# EAGLE board project-tsc (EAGLE 9.7.0), part 1 of 2
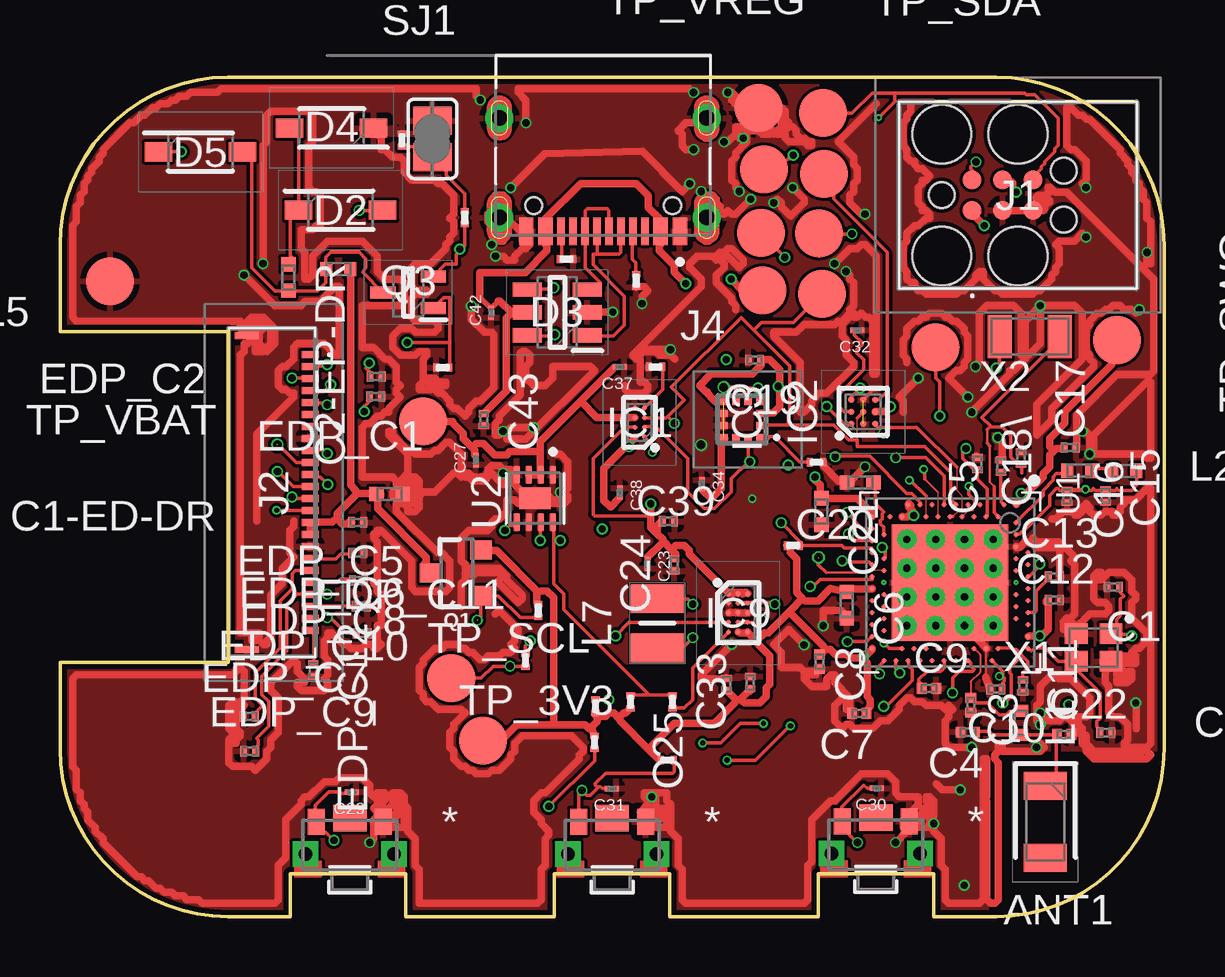
[diagram p1: board, top side]
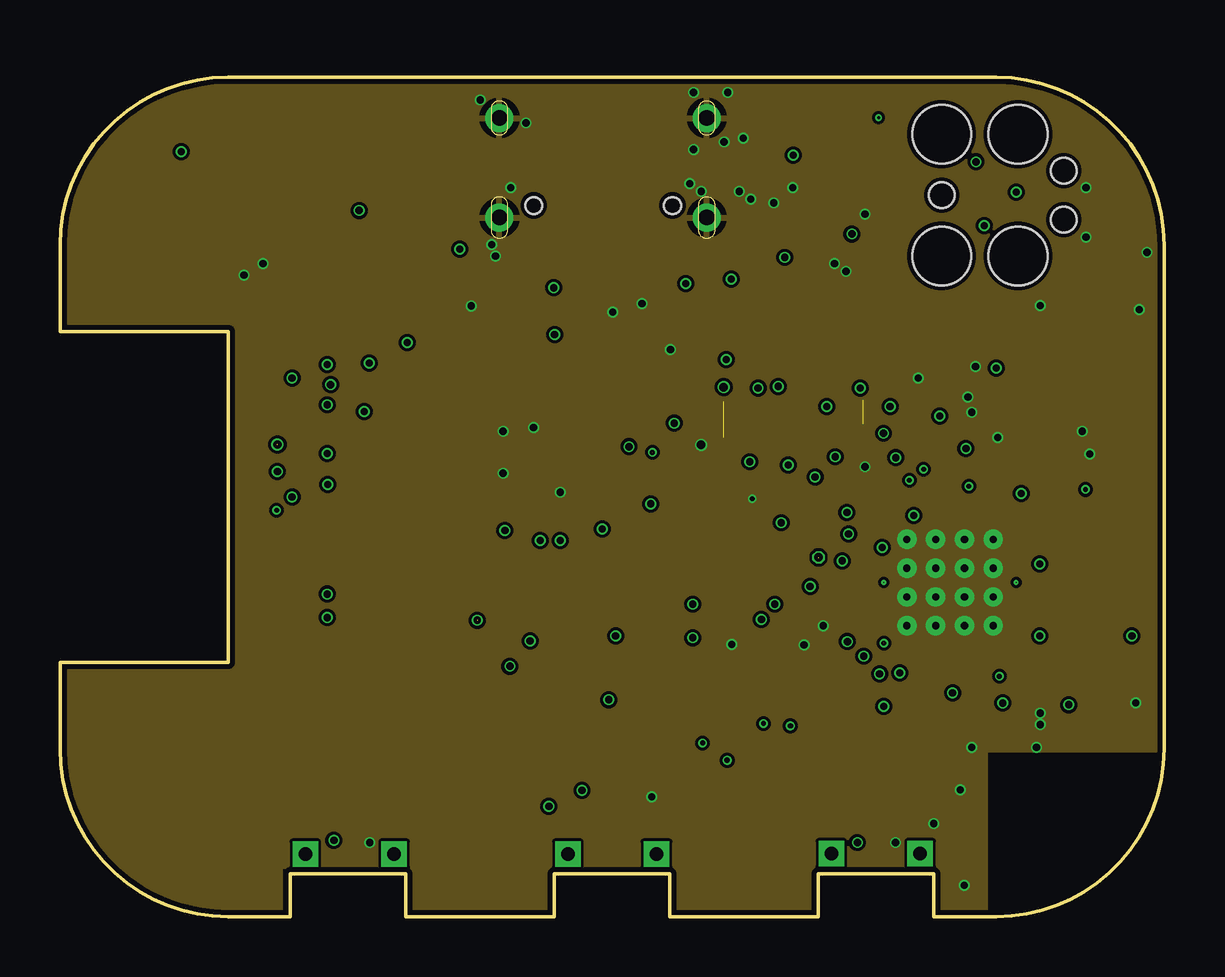
[diagram p2: board, inner layer Route2]
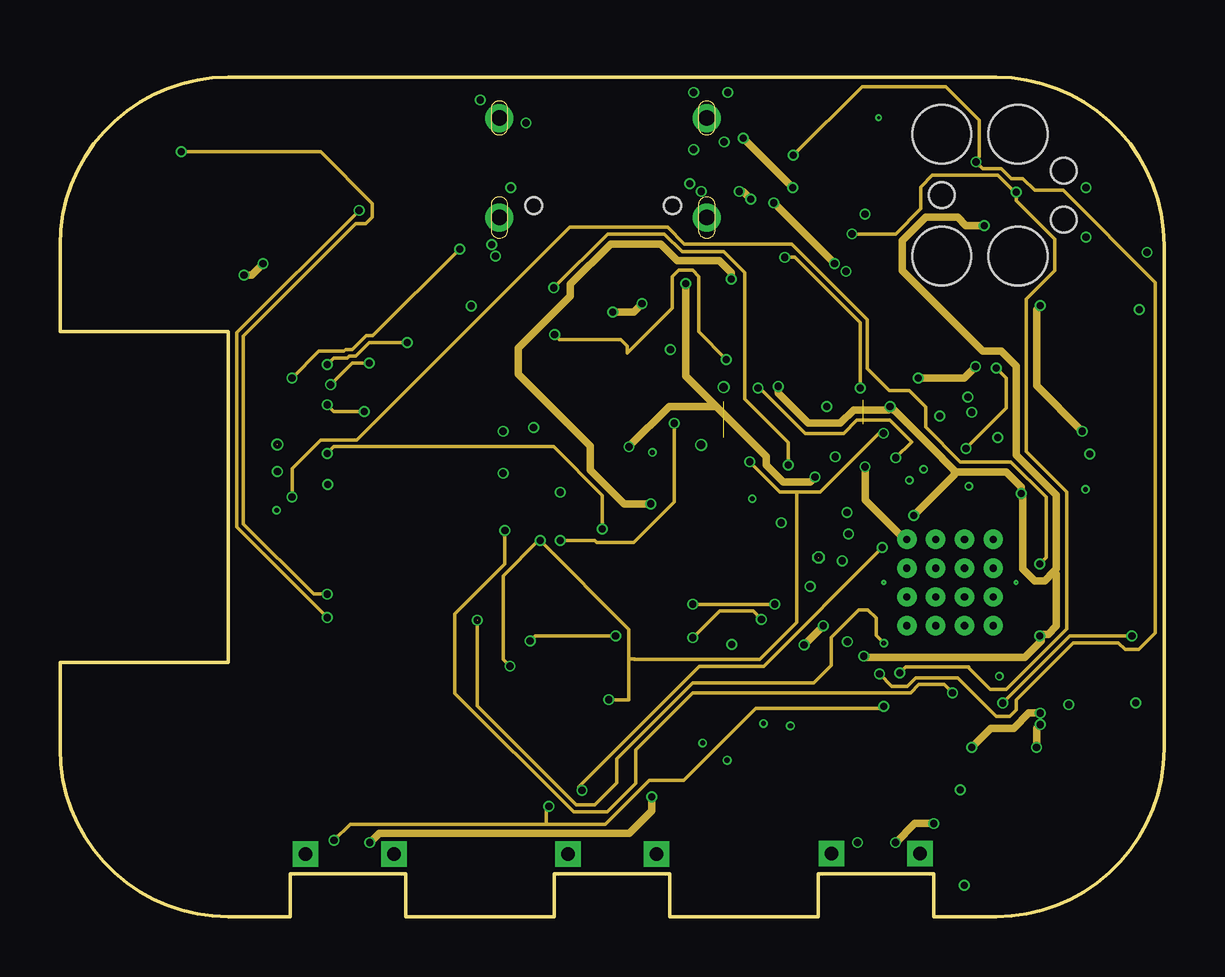
[diagram p3: board, inner layer Route15]
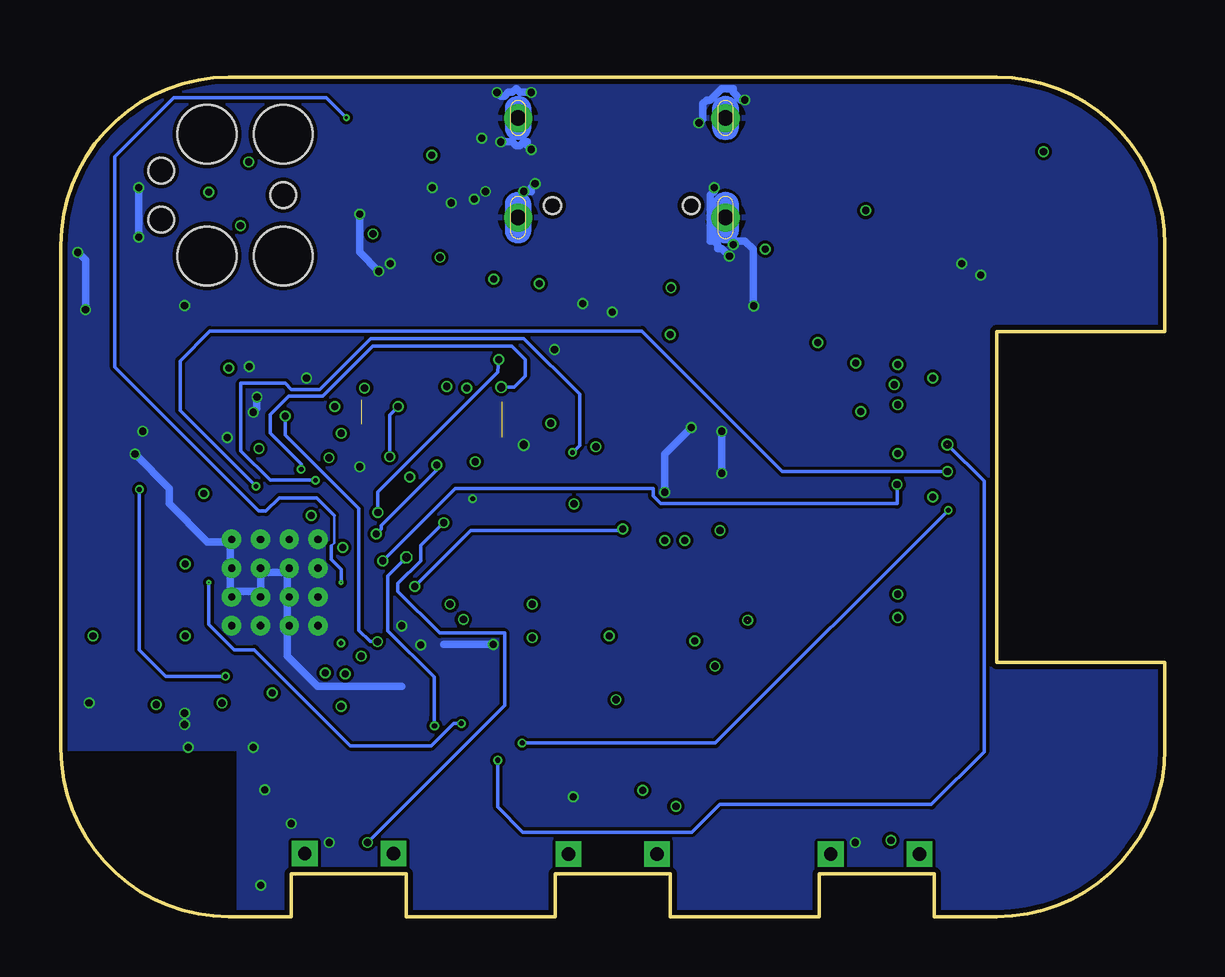
[diagram p4: board, bottom side, seen from below]

Size 46 x 35 mm. Coordinates in mm from the lower left corner, seen from the top.
Outline: 39,0 36.4,0 36.4,1.8 31.6,1.8 31.6,0 25.4,0 25.4,1.8 20.6,1.8 20.6,0 14.4,0 14.4,1.8 9.6,1.8 9.6,0 7,0 arc-90 0,7 0,10.6 7,10.6 7,24.4 0,24.4 0,28 arc-90 7,35 39,35 arc-90 46,28 46,7 arc-90 39,0
Copper layers (1+2*15+16): Top 0.035mm / dielectric 1.6mm / Route2 0.035mm / dielectric 0.15mm / Route15 0.035mm / dielectric 0.2mm / Bottom 0.035mm
Design rules "jlcpcb-2layers.dru *": minimum track width 6mil, minimum drill 0.2mm, track to track 5mil, track to pad 5mil, pad to pad 5mil, via to via 5mil, smd to smd 5mil, copper to edge 0.2mm, drill to drill 6mil, minimum pad ring 10mil, minimum via ring 3mil, stop-mask expansion 4mil, vias tented up to drill 999mm, thermal gap 10mil
Net classes: 1 POWER: width 0.305 mm

## Footprints (pad centres in the part's own frame; a part is rotated, then mirrored left to right if it is on the bottom)
2450AT18B100E_ANTC3216X140N = smd 1.15 x 1.8: 1 -1.5,0; 2 1.5,0
NORDIC_NRF_3_RESC0201_L = smd 0.28 x 0.43: 1 -0.255,0; 2 0.255,0
NORDIC_NRF_3_RESC0402_N = smd 0.6 x 0.6: 1 -0.55,0; 2 0.55,0
NORDIC_NRF_3_RESC0201_N = smd 0.4 x 0.45: 1 -0.305,0; 2 0.305,0
GRM011R60J152KE01L_2_CAPC0201X13N = smd 0.22 x 0.23: 1 -0.185,0; 2 0.185,0
ESP32_C6_LIBRARY_5_SOD3716X135N = smd 1.15 x 0.8: 1 -1.75,0; 2 1.75,0
ESP32_C6_LIBRARY_3_SOT95P280X145-6N = smd 1.2 x 0.6: 1 -1.25,0.95; 2 -1.25,0; 3 -1.25,-0.95; 4 1.25,-0.95; 5 1.25,0; 6 1.25,0.95
BQ25180YBGR_BGA8C40P2X4_100X155X50 = smd 0.2 x 0.2: A1 -0.2,0.6; A2 0.2,0.6; B1 -0.2,0.2; B2 0.2,0.2; C1 -0.2,-0.2; C2 0.2,-0.2; D1 -0.2,-0.6; D2 0.2,-0.6
DRV2605YZFR_BGA9C50P3X3_144X144X62 = smd 0.25 x 0.25: A1 -0.5,0.5; A2 0,0.5; A3 0.5,0.5; B1 -0.5,0; B2 0,0; B3 0.5,0; C1 -0.5,-0.5; C2 0,-0.5; C3 0.5,-0.5
BMA423_BMA423 = smd 0.3 x 0.35: 1 -0.75,-0.775; 2 -0.25,-0.775; 3 0.25,-0.775; 4 0.75,-0.775; 7 0.75,0.775; 8 0.25,0.775; 9 -0.25,0.775; 10 -0.75,0.775 | smd 0.35 x 0.3: 5 0.775,-0.25; 6 0.775,0.25; 11 -0.775,0.25; 12 -0.775,-0.25
RT6160AWSC_BGA15C40P3X5_140X230X60 = smd 0.216 x 0.216: A1 -0.4,0.8; A2 0,0.8; A3 0.4,0.8; B1 -0.4,0.4; B2 0,0.4; B3 0.4,0.4; C1 -0.4,0; C2 0,0; C3 0.4,0; D1 -0.4,-0.4; D2 0,-0.4; D3 0.4,-0.4; E1 -0.4,-0.8; E2 0,-0.8; E3 0.4,-0.8
TC2030-IDC_TC2030IDC = smd 0.783 x 0.783: 1 -0.953,-0.635; 2 -0.953,0.635; 3 0.317,-0.635; 4 0.317,0.635; 5 1.588,-0.635; 6 1.588,0.635 | hole 2.451: -2.223,-2.54; -2.223,2.54; 0.952,-2.54; 0.952,2.54 | hole 1.067: -2.223,0; 2.857,-1.016; 2.857,1.016
503480-2400_5034802400 = smd 0.3 x 0.7: 1 -5.75,1.525; 2 -5.25,1.525; 3 -4.75,1.525; 4 -4.25,1.525; 5 -3.75,1.525; 6 -3.25,1.525; 7 -2.75,1.525; 8 -2.25,1.525; 9 -1.75,1.525; 10 -1.25,1.525; 11 -0.75,1.525; 12 -0.25,1.525; 13 0.25,1.525; 14 0.75,1.525; 15 1.25,1.525; 16 1.75,1.525; 17 2.25,1.525; 18 2.75,1.525; 19 3.25,1.525; 20 3.75,1.525; 21 4.25,1.525; 22 4.75,1.525; 23 5.25,1.525; 24 5.75,1.525 | smd 0.3 x 1: MP1 -6.54,-1.125; MP2 6.54,-1.125
KH-TYPE-C-16P_KINGHELM_KH-TYPE-C-16P = smd 0.6 x 1.15: A1_B12 -3.2,4.725; A4_B9 -2.4,4.725; A9_B4 2.4,4.725; A12_B1 3.2,4.725 | smd 0.3 x 1.15: A5 -1.25,4.725; A6 -0.25,4.725; A7 0.25,4.725; A8 1.25,4.725; B5 1.75,4.725; B6 0.75,4.725; B7 -0.75,4.725; B8 -1.75,4.725 | drill 0.65 pad 1.05: SH1 -4.32,0; SH2 4.32,0; SH3 -4.32,4.15; SH4 4.32,4.15 | hole 0.7: -2.89,3.65; 2.89,3.65
NORDIC_NRF_2_RESC0402_L = smd 0.5 x 0.6: 1 -0.5,0; 2 0.5,0
MLP2016SR47MT0S1_INDC2016X100N = smd 1.2 x 2.2: 1 -1.028,0; 2 1.028,0
ESP32_C6_LIBRARY_4_ESP32_C6_LIBRARY_4_ESP32_C6_LIBRARY_4_ESP32_C6_LIBRARY_4_ESP32_WROVER_SPARKFUN-DISCRETESEMI_SOT23-3 = smd 0.8 x 0.9: 1 -0.95,-1; 2 0.95,-1; 3 0,1.1
ESP32_C6_LIBRARY_6_SOT65P210X110-3N = smd 1.05 x 0.5: 1 -1.05,0.65; 2 -1.05,-0.65; 3 1.05,0
CPF0201D7K68C1_0201 = smd 0.35 x 0.25: 1 0,0.275; 2 0,-0.275
ESP32_C6_LIBRARY_7_JUMPER_SJ = smd 1.168 x 1.6: 1 -0.762,0; 2 0.762,0
2025-10-22_07-23-44_LIBRARY_SW_EVP-AKE31A_PAN = smd 0.711 x 1.092: 1 -1.4,-0.972; 2 1.4,-0.972 | drill 0.559 pad 0.914 square: 3 -1.848,0.381; 4 1.848,0.381 | smd 1.397 x 1.092: 5 0,-1.124
HECTOR_WATCH_1_TP20R = smd 2 x 2: TP 0,0
NORDIC_NRF_4_AQFN50P700X700X85_HS-74N = smd 4.85 x 4.85: P$74 0,0 | drill 0.3 pad 0.6: P$75 -1.8,1.8; P$76 -0.6,1.8; P$77 0.6,1.8; P$78 1.8,1.8; P$79 -1.8,0.6; P$80 -0.6,0.6; P$81 0.6,0.6; P$82 1.8,0.6; P$83 -1.8,-0.6; P$84 -0.6,-0.6; P$85 0.6,-0.6; P$86 1.8,-0.6; P$87 -1.8,-1.8; P$88 -0.6,-1.8; P$89 0.6,-1.8; P$90 1.8,-1.8 | smd 0.2 x 0.2: P$A8 -1.25,3.25; P$A10 -0.75,3.25; P$A12 -0.25,3.25; P$A14 0.25,3.25; P$A16 0.75,3.25; P$A18 1.25,3.25; P$A20 1.75,3.25; P$A22 2.25,3.25; P$A23 2.75,3.25; P$AA24 3.25,-2.25; P$AB2 -2.75,-2.5; P$AC5 -2,-2.75; P$AC9 -1,-2.75; P$AC11 -0.5,-2.75; P$AC13 0,-2.75; P$AC15 0.5,-2.75; P$AC17 1,-2.75; P$AC19 1.5,-2.75; P$AC21 2,-2.75; P$AC24 3.25,-2.75; P$AD2 -2.75,-3.25; P$AD4 -2.25,-3.25; P$AD6 -1.75,-3.25; P$AD8 -1.25,-3.25; P$AD10 -0.75,-3.25; P$AD12 -0.25,-3.25; P$AD14 0.25,-3.25; P$AD16 0.75,-3.25; P$AD18 1.25,-3.25; P$AD20 1.75,-3.25; P$AD22 2.25,-3.25; P$AD23 2.75,-3.25; P$B1 -3.25,2.75; P$B3 -2.5,2.75; P$B5 -2,2.75; P$B7 -1.5,2.75; P$B9 -1,2.75; P$B11 -0.5,2.75; P$B13 0,2.75; P$B15 0.5,2.75; P$B17 1,2.75; P$B19 1.5,2.75; P$B24 3.25,2.75; P$C1 -3.25,2.25; P$D2 -2.75,2; P$D23 2.75,2; P$E24 3.25,1.75; P$F2 -2.75,1.5; P$F23 2.75,1.5; P$G1 -3.25,1.25; P$H2 -2.75,1; P$H23 2.75,1; P$J1 -3.25,0.75; P$J24 3.25,0.75; P$K2 -2.75,0.5; P$L1 -3.25,0.25; P$L24 3.25,0.25; P$M2 -2.75,0; P$N1 -3.25,-0.25; P$N24 3.25,-0.25; P$P2 -2.75,-0.5; P$P23 2.75,-0.5; P$R1 -3.25,-0.75; P$R24 3.25,-0.75; P$T2 -2.75,-1; P$T23 2.75,-1; P$U1 -3.25,-1.25; P$U24 3.25,-1.25; P$V23 2.75,-1.5; P$W1 -3.25,-1.75; P$W24 3.25,-1.75; P$Y2 -2.75,-2; P$Y23 2.75,-2
ESP32_C6_LIBRARY_SON50P200X200X80-9N = smd 0.76 x 0.27: 1 -0.985,0.75; 2 -0.985,0.25; 3 -0.985,-0.25; 4 -0.985,-0.75; 5 0.985,-0.75; 6 0.985,-0.25; 7 0.985,0.25; 8 0.985,0.75 | smd 0.9 x 1.3: 9 0,0
NORDIC_NRF_BT-XTAL_2016_N = smd 0.95 x 0.85: 1 -0.725,-0.575; 2 0.725,-0.575; 3 0.725,0.575; 4 -0.725,0.575
NORDIC_NRF_1_XTAL_3215_N = smd 1 x 1.8: 1 -1.25,0; 2 1.25,0

## Placement (x,y rotation side)
ANT1  2450AT18B100E  [2450AT18B100E_ANTC3216X140N]  41.05,3.96 270 top
C1  12pF  [NORDIC_NRF_3_RESC0201_L]  43.89,13.75 180 top
C1-ED-DR  10uF  [NORDIC_NRF_3_RESC0402_N]  13.73,17.62 0 top
C2  12pF  [NORDIC_NRF_3_RESC0201_L]  43.58,7.68 180 top
C2-EP-DR  4.7uF  [NORDIC_NRF_3_RESC0402_N]  9.52,26.65 270 top
C3  1pF  [NORDIC_NRF_3_RESC0201_N]  37.95,8.82 270 top
C4  1pF  [NORDIC_NRF_3_RESC0201_N]  37.83,7.7 180 top
C5  100nF  [NORDIC_NRF_3_RESC0201_L]  39.21,18.79 90 top
C6  4.7uF  [NORDIC_NRF_3_RESC0402_N]  32.78,12.99 270 top
C7  100nF  [NORDIC_NRF_3_RESC0201_N]  33.31,8.47 180 top
C8  100nF  [NORDIC_NRF_3_RESC0201_N]  31.64,10.63 270 top
C9  820pF  [NORDIC_NRF_3_RESC0201_N]  36.21,9.52 0 top
C10  N.C.  [NORDIC_NRF_3_RESC0201_L]  39,9.49 180 top
C11  100pF  [NORDIC_NRF_3_RESC0201_L]  40.13,9.62 270 top
C12  100nF  [NORDIC_NRF_3_RESC0201_L]  41.43,13.21 0 top
C13  N.C.  [NORDIC_NRF_3_RESC0201_L]  41.43,14.17 0 top
C14  4.7uF  [NORDIC_NRF_3_RESC0201_L]  42.09,19.56 0 top
C15  1.0uF  [NORDIC_NRF_3_RESC0201_L]  43.56,17.54 270 top
C16  47nF  [NORDIC_NRF_3_RESC0201_L]  41.96,17.52 270 top
C17  12pF  [NORDIC_NRF_3_RESC0201_L]  40.04,19.13 270 top
C18\  12pF  [NORDIC_NRF_3_RESC0201_L]  38.23,18.89 270 top
C19  100nF  [NORDIC_NRF_3_RESC0201_L]  28.94,23.2 180 top
C20  4.7uF  [NORDIC_NRF_3_RESC0402_N]  33.34,18.1 180 top
C21  4.7uF  [NORDIC_NRF_3_RESC0402_N]  31.73,16.9 270 top
C22  N.C.  [NORDIC_NRF_3_RESC0201_N]  41.85,7.6 0 top
C23  0.1uF  [GRM011R60J152KE01L_2_CAPC0201X13N]  24.48,14.71 270 top
C24  10uF  [NORDIC_NRF_3_RESC0201_L]  25.6,14.67 90 top
C25  22uF  [NORDIC_NRF_3_RESC0201_L]  27.77,9.69 90 top
C27  0.1uF  [GRM011R60J152KE01L_2_CAPC0201X13N]  17.32,19.03 90 top
C29  1uF  [GRM011R60J152KE01L_2_CAPC0201X13N]  12.15,5.2 180 top
C30  1uF  [GRM011R60J152KE01L_2_CAPC0201X13N]  34.03,5.36 180 top
C31  1uF  [GRM011R60J152KE01L_2_CAPC0201X13N]  22.99,5.35 180 top
C32  1uF  [GRM011R60J152KE01L_2_CAPC0201X13N]  33.22,24.45 180 top
C33  22uF  [NORDIC_NRF_3_RESC0201_L]  28.76,9.77 90 top
C34  0.1uF  [GRM011R60J152KE01L_2_CAPC0201X13N]  26.75,18.03 270 top
C37  1uF  [GRM011R60J152KE01L_2_CAPC0201X13N]  23.33,22.92 180 top
C38  1uF  [GRM011R60J152KE01L_2_CAPC0201X13N]  23.33,17.68 270 top
C39  10uF  [NORDIC_NRF_3_RESC0201_L]  25.35,16.49 0 top
C42  0.1uF  [GRM011R60J152KE01L_2_CAPC0201X13N]  17.97,25.17 90 top
C43  4.7uF  [NORDIC_NRF_3_RESC0201_L]  17.65,20.72 270 top
D2  MBR0530  [ESP32_C6_LIBRARY_5_SOD3716X135N]  11.69,29.46 0 top
D3  USBLC6-2SC6Y  [ESP32_C6_LIBRARY_3_SOT95P280X145-6N]  20.72,25.19 180 top
D4  MBR0530  [ESP32_C6_LIBRARY_5_SOD3716X135N]  11.32,32.88 180 top
D5  MBR0530  [ESP32_C6_LIBRARY_5_SOD3716X135N]  5.85,31.88 0 top
EDP_C1  1uF  [NORDIC_NRF_3_RESC0201_L]  13.15,21.69 180 top
EDP_C2  1uF  [NORDIC_NRF_3_RESC0201_L]  13.17,22.52 180 top
EDP_C5  0.1uF/50V  [NORDIC_NRF_3_RESC0201_L]  12.4,16.44 180 top
EDP_C6  1uF/50V  [NORDIC_NRF_3_RESC0201_L]  12.41,15.16 180 top
EDP_C7  1uF/50V  [NORDIC_NRF_3_RESC0201_L]  7.88,8.35 0 top
EDP_C8  1uF/50V  [NORDIC_NRF_3_RESC0201_L]  12.44,14.02 180 top
EDP_C9  1uF/50V  [NORDIC_NRF_3_RESC0201_L]  7.9,6.91 0 top
EDP_C10  1uF/50V  [NORDIC_NRF_3_RESC0201_L]  12.55,12.94 180 top
EDP_C11  1uF/50V  [NORDIC_NRF_3_RESC0201_L]  12.6,11.81 0 top
EDP_C12  1uF/50V  [NORDIC_NRF_3_RESC0201_L]  10.55,10.28 270 top
IC1  BQ25180YBGR  [BQ25180YBGR_BGA8C40P2X4_100X155X50]  24.15,20.61 180 top
IC2  DRV2605YZFR  [DRV2605YZFR_BGA9C50P3X3_144X144X62]  33.47,21.05 90 top
IC3  BMA421  [BMA423_BMA423]  28.41,20.73 90 top
IC9  RT6160AWSC  [RT6160AWSC_BGA15C40P3X5_140X230X60]  28.25,12.67 0 top
J1  TC2030-IDC_TC2030-IDC  [TC2030-IDC_TC2030IDC]  38.96,30.08 0 top
J2  503480-2400_503480-2400  [503480-2400_5034802400]  8.9,17.68 270 top
J4  KH-TYPE-C-16P  [KH-TYPE-C-16P_KINGHELM_KH-TYPE-C-16P]  22.63,33.3 180 top
L1  3.9nH  [NORDIC_NRF_2_RESC0402_L]  40.03,8.09 270 top
L2  10uH  [NORDIC_NRF_2_RESC0402_L]  42.46,18.59 0 top
L3\  15nH  [NORDIC_NRF_2_RESC0402_L]  44.35,18.59 0 top
L5  68uH  [NORDIC_NRF_2_RESC0402_L]  11.6,27 180 top
L7  FTC252012SR47MBCA  [MLP2016SR47MT0S1_INDC2016X100N]  24.89,12.23 270 top
Q1  20V/4.2A/52mΩ/1.4W  [ESP32_C6_LIBRARY_4_ESP32_C6_LIBRARY_4_ESP32_C6_LIBRARY_4_ESP32_C6_LIBRARY_4_ESP32_WROVER_SPARKFUN-DISCRETESEMI_SOT23-3]  16.54,14.33 90 top
Q3  SI1308EDL-T1-GE3  [ESP32_C6_LIBRARY_6_SOT65P210X110-3N]  14.51,26.03 180 top
R1  0  [CPF0201D7K68C1_0201]  19.4,10.69 180 top
R1_EP_DR1  0.47  [CPF0201D7K68C1_0201]  16.86,29.14 180 top
R1_USB  5K1  [CPF0201D7K68C1_0201]  24.01,26.52 180 top
R2  0  [CPF0201D7K68C1_0201]  25.52,8.96 0 top
R2_EP_DR  10K  [CPF0201D7K68C1_0201]  15.95,22.89 270 top
R2_USB  5K1  [CPF0201D7K68C1_0201]  21.1,27.41 90 top
R3  0  [CPF0201D7K68C1_0201]  31.52,18.95 270 top
R5  10K  [CPF0201D7K68C1_0201]  30.55,15.48 90 top
R7  10K  [CPF0201D7K68C1_0201]  22.27,7.27 0 top
R8  10K  [CPF0201D7K68C1_0201]  25.31,6.53 90 top
R9  10K  [CPF0201D7K68C1_0201]  24.82,22.92 90 top
R17  3K3  [CPF0201D7K68C1_0201]  22.32,8.78 0 top
R18  3K3  [CPF0201D7K68C1_0201]  23.77,8.95 0 top
R_PWR_EPD  10K  [CPF0201D7K68C1_0201]  19.93,12.77 0 top
R_TYPE_SEL  2.2  [CPF0201D7K68C1_0201]  14.26,32.38 180 top
SJ1  [ESP32_C6_LIBRARY_7_JUMPER_SJ]  15.52,32.43 270 top
SW_DN  2025-10-22_07-23-44_LIBRARY_EVP-AKE31ASW_EVP-AKE31A_PAN  [2025-10-22_07-23-44_LIBRARY_SW_EVP-AKE31A_PAN]  12.07,2.99 180 top
SW_ENT  2025-10-22_07-23-44_LIBRARY_EVP-AKE31ASW_EVP-AKE31A_PAN  [2025-10-22_07-23-44_LIBRARY_SW_EVP-AKE31A_PAN]  23.01,2.99 180 top
SW_UP  2025-10-22_07-23-44_LIBRARY_EVP-AKE31ASW_EVP-AKE31A_PAN  [2025-10-22_07-23-44_LIBRARY_SW_EVP-AKE31A_PAN]  33.99,3.01 180 top
TP_3V3  HECTOR_WATCH_1_TPTP20R  [HECTOR_WATCH_1_TP20R]  17.62,7.35 0 top
TP_3V3_2  HECTOR_WATCH_1_TPTP20R  [HECTOR_WATCH_1_TP20R]  44.04,24.04 0 top
TP_BAT_GND  HECTOR_WATCH_1_TPTP20R  [HECTOR_WATCH_1_TP20R]  2.09,26.49 0 top
TP_GND  HECTOR_WATCH_1_TPTP20R  [HECTOR_WATCH_1_TP20R]  29.11,33.72 0 top
TP_ON  HECTOR_WATCH_1_TPTP20R  [HECTOR_WATCH_1_TP20R]  31.84,30.96 0 top
TP_OP  HECTOR_WATCH_1_TPTP20R  [HECTOR_WATCH_1_TP20R]  29.22,28.5 0 top
TP_RESET  HECTOR_WATCH_1_TPTP20R  [HECTOR_WATCH_1_TP20R]  31.79,33.5 0 top
TP_SCL  HECTOR_WATCH_1_TPTP20R  [HECTOR_WATCH_1_TP20R]  16.3,9.94 0 top
TP_SDA  HECTOR_WATCH_1_TPTP20R  [HECTOR_WATCH_1_TP20R]  31.76,25.97 0 top
TP_SWDCLK  HECTOR_WATCH_1_TPTP20R  [HECTOR_WATCH_1_TP20R]  31.62,28.48 0 top
TP_SWDIO  HECTOR_WATCH_1_TPTP20R  [HECTOR_WATCH_1_TP20R]  29.33,31.16 0 top
TP_SWO  HECTOR_WATCH_1_TPTP20R  [HECTOR_WATCH_1_TP20R]  36.49,23.74 0 top
TP_VBAT  HECTOR_WATCH_1_TPTP20R  [HECTOR_WATCH_1_TP20R]  15.13,20.65 0 top
TP_VREG  HECTOR_WATCH_1_TPTP20R  [HECTOR_WATCH_1_TP20R]  29.28,26.11 0 top
U1  NRF52840_QF  [NORDIC_NRF_4_AQFN50P700X700X85_HS-74N]  37.09,13.93 270 top
U2  ESP32_C6_LIBRARY_MAX17048G+T10  [ESP32_C6_LIBRARY_SON50P200X200X80-9N]  19.79,17.44 270 top
X1  32MHz  [NORDIC_NRF_BT-XTAL_2016_N]  43.07,11.22 180 top
X2  32.726kHz  [NORDIC_NRF_1_XTAL_3215_N]  40.41,24.18 0 top